# Altium schematic sheet Wheatstone bridge part III.SchDoc: Wheatstone bridge part III
size A4; SheetNumber: 4; SheetTotal: 5
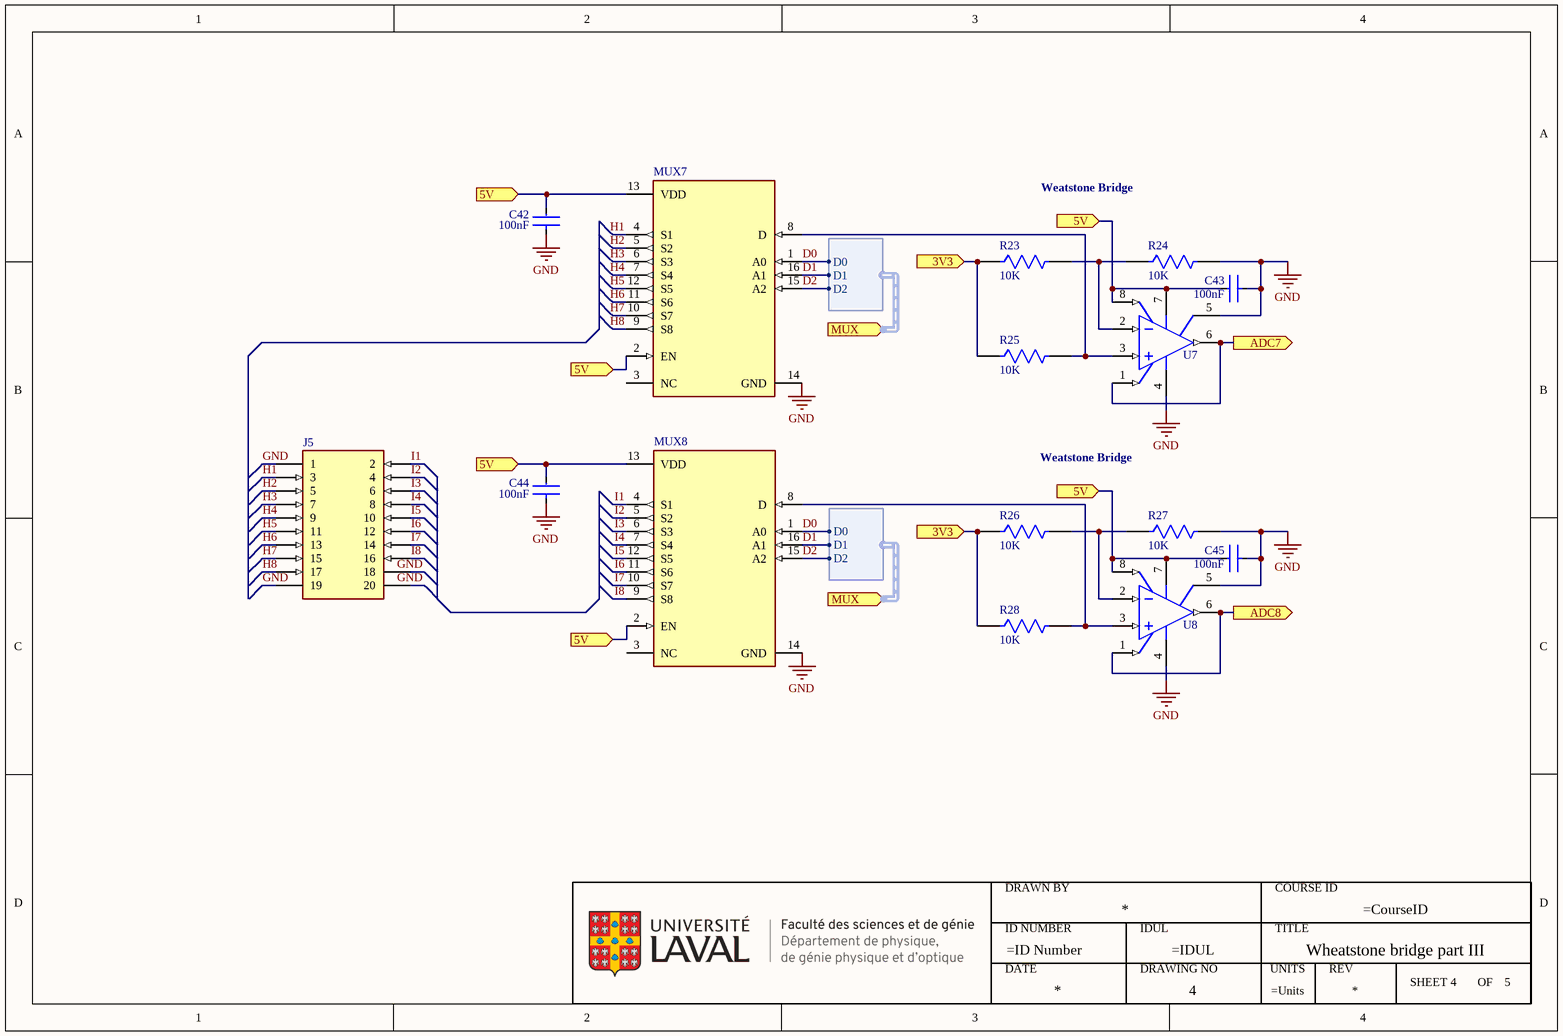
[diagram p0: Wheatstone bridge part III.SchDoc]

## Parts
*5  ULaval FSG-DPGPO  (value not drawn)  (graphical)
C42  value 100nF  [FP-CC0603-DA-IPC_B]  (hidden comment: CC0603JRX7R9BB104)
C43  value 100nF  [FP-CC0603-DA-IPC_B]  (hidden comment: CC0603JRX7R9BB104)
C44  value 100nF  [FP-CC0603-DA-IPC_B]  (hidden comment: CC0603JRX7R9BB104)
C45  value 100nF  [FP-CC0603-DA-IPC_B]  (hidden comment: CC0603JRX7R9BB104)
J5  SFC-110-T1-F-D-A  [SFC-110-T1-F-D-A-Footprint-2]  (value not drawn)
MUX7  TMUX1208PWR  [TMUX1208PWR]  (value not drawn)
MUX8  TMUX1208PWR  [TMUX1208PWR]  (value not drawn)
R23  value 10K  [FP-RT0603-IPC_B]  (hidden comment: RT0603BRD0710KL)
R24  value 10K  [FP-RT0603-IPC_B]  (hidden comment: RT0603BRD0710KL)
R25  value 10K  [FP-RT0603-IPC_B]  (hidden comment: RT0603BRD0710KL)
R26  value 10K  [FP-RT0603-IPC_B]  (hidden comment: RT0603BRD0710KL)
R27  value 10K  [FP-RT0603-IPC_B]  (hidden comment: RT0603BRD0710KL)
R28  value 10K  [FP-RT0603-IPC_B]  (hidden comment: RT0603BRD0710KL)
U7  MCP6N11-100E/SN  [MCP6N11-100E/SN]  (value not drawn)
U8  MCP6N11-100E/SN  [MCP6N11-100E/SN]  (value not drawn)

## Ports
3V3 (in), 5V (in), ADC7 (out), ADC8 (out), MUX (in, harness *)

## Harnesses
*: D0, D1, D2

## Nets
GND: C42.1 C43.1 C44.1 C45.1 J5.1 J5.18 J5.19 J5.20 MUX7.14(GND) MUX8.14(GND) R24.2 R27.2 U7.4(VSS) U7.5(VREF) U8.4(VSS) U8.5(VREF)
3V3: R23.1 R25.1 R26.1 R28.1 ; port 3V3
5V: C42.2 C43.2 C44.2 C45.2 MUX7.2(EN) MUX7.13(VDD) MUX8.2(EN) MUX8.13(VDD) U7.7(VDD) U7.8(EN/~{CAL}) U8.7(VDD) U8.8(EN/~{CAL}) ; port 5V
ADC7: U7.1(VFG) U7.6(VOUT) ; port ADC7
ADC8: U8.1(VFG) U8.6(VOUT) ; port ADC8
D0: MUX7.1(A0) MUX8.1(A0) ; port MUX.D0
D1: MUX7.16(A1) MUX8.16(A1) ; port MUX.D1
D2: MUX7.15(A2) MUX8.15(A2) ; port MUX.D2
H1: J5.3 MUX7.4(S1)
H2: J5.5 MUX7.5(S2)
H3: J5.7 MUX7.6(S3)
H4: J5.9 MUX7.7(S4)
H5: J5.11 MUX7.12(S5)
H6: J5.13 MUX7.11(S6)
H7: J5.15 MUX7.10(S7)
H8: J5.17 MUX7.9(S8)
I1: J5.2 MUX8.4(S1)
I2: J5.4 MUX8.5(S2)
I3: J5.6 MUX8.6(S3)
I4: J5.8 MUX8.7(S4)
I5: J5.10 MUX8.12(S5)
I6: J5.12 MUX8.11(S6)
I7: J5.14 MUX8.10(S7)
I8: J5.16 MUX8.9(S8)
NetMUX7_8: MUX7.8(D) R25.2 U7.3(VIP)
NetMUX8_8: MUX8.8(D) R28.2 U8.3(VIP)
NetR23_2: R23.2 R24.1 U7.2(VIM)
NetR26_2: R26.2 R27.1 U8.2(VIM)

Not connected (* = marked no-connect by the designer): MUX7 3(NC); MUX8 3(NC)

## Notes on the sheet
- Weatstone Bridge
- (in symbol ULaval FSG-DPGPO) DRAWN BY; COURSE ID; ID NUMBER; IDUL; TITLE; DATE; DRAWING NO; UNITS; REV; SHEET; OF

## Library data of the parts
C42-C45 = CMP-001-00097-1: 0603 0.1 uF 50 V ±5 % Tolerance X7R SMT Multilayer Ceramic Capacitor; Voltage Rating: 50V; Tolerance: 5%; Halogen Free: Halogen Free; Depth: 0.8mm; Case/Package: 0603; Dielectric: X7R; Thickness: 0.035inch; Series: CC; Termination: SMD/SMT; Voltage Rating (DC): 50V; Max Operating Temperature: 125°C; Weight: 7.1E-05oz; Construction: Flat; Resistor Type: Ceramic; Height: 0.8mm; Length: 0.063inch; RoHS Compliant: Yes; Lead Free: Lead Free; Pins: 2; Min Operating Temperature: -55°C; Case Code (Imperial): 0603; Radiation Hardening: No; Case Code (Metric): 1608; Mounting Technology: Surface Mount; Width: 0.031inch; Packaging: Tape and Reel
J5 = CMP-002-00080-2: Headers & Wire Housings .050 Tiger Eye Cost-Effective Reliable Socket Strip; Pitch: 0.05inch; Voltage Rating (AC): 350V; Connector Type: Receptacle; Number of Contacts: 20; Gender: Female; Insulation Color: Black; Max Operating Temperature: 125°C; Min Operating Temperature: -55°C; Insulation Material: Polymer; RoHS Compliant: Yes; Row Spacing: 0.05inch; Number of Rows: 2; Contact Shape: Square; Contact Type: Female Socket; Mounting Technology: Through Hole; Termination: Solder; Fastening Type: Pull; Contact Finish - Mating: GOLD; Color: Black; Packaging: Rail/Tube; Contact Material: Bronze; Contact Plating: Gold; Number of Positions: 20; Series: Tiger Eye™ SFC
MUX7 MUX8 = TMUX1208PWR: 5-V, 8: 1, 1-channel general-purpose analog multiplexer with 1.8-V input logic 16-TSSOP -40 to 125; Supplier 1: Digi-Key; Supplier Part Number 1: 296-51847-1-ND; Supplier 2: Digi-Key; Supplier Part Number 2: 296-51847-6-ND; Supplier 3: Digi-Key; Supplier Part Number 3: 296-51847-2-ND; ComponentLink1Description: Datasheet; ComponentLink1URL: https://www.ti.com/lit/ds/symlink/tmux1208.pdf?HQS=dis-dk-null-digikeymode-dsf-pf-null-wwe&ts=1678139087624&ref_url=https%253A%252F%252Fwww.ti.com%252Fgeneral%252Fdocs%252Fsuppproductinfo.tsp%253FdistId%253D10%2526gotoUrl%253Dhttps%253A%252F%252Fwww.ti.com%252Flit%252Fgpn%252Ftmux1208
R23-R28 = CMP-009-00178-1: Res High precision Thin Film 0603 10K Ohm 0.1% 1/10W ±25ppm/°C Molded SMD Paper T/R; Max Power Dissipation: 100mW; Working Voltage: 75V; RoHS Compliant: Yes; Power Rating: 100mW; Lead Free: Lead Free; Depth: 0.8mm; Case Code (Imperial): 0603; Max Operating Temperature: 155°C; Voltage Rating: 75V; Package Quantity: 5000; Packaging: Tape and Reel; Case/Package: 0603; Height: 0.022inch; Construction: Rectangular; Min Operating Temperature: -55°C; Termination: SMD/SMT; Features: Moisture Resistant; Number of Terminations: 2; Case Code (Metric): 1608; Technology: THIN FILM; Military Standard: Not; Length: 0.063inch; Voltage Rating (DC): 75V; Temperature Coefficient: 25ppm/°C; Weight: 7.1E-05oz; Width: 0.8mm; Series: RT; Resistor Type: Thin Film
U7 U8 = CMP-014-00010-7: MCP6N11 Series Single Channel 500 KHz 5.5 V Instrumentation Amplifier - SOIC-8; Bandwidth: 500kHz; Min Supply Voltage: 1.8V; Number of Elements: 2; Gain Bandwidth Product: 35MHz; Input Offset Voltage (Vos): 350uV; Number of Channels: 1; Nominal Supply Current: 800uA; Common Mode Rejection Ratio: 86dB; Slew Rate: 6V/µs; Max Supply Voltage: 5.5V; Slew Rate-Nom: 9V/µs; Input Bias Current: 10pA; Mounting Technology: Surface Mount; Package Quantity: 100; Pins: 8; Width: 3.9mm; Length: 4.9mm; Case/Package: SOIC; Min Operating Temperature: -40°C; Radiation Hardening: No; RoHS Compliant: Yes; Unity Gain Bandwidth Product: 35MHz; Lead Free: Lead Free; Number of Amplifiers: 1; Max Operating Temperature: 125°C; Height: 1.25mm; Packaging: Rail/Tube; Input Offset Voltage-Max: 350uV; Reach SVHC Compliant: Yes; Supply Current: 800uA; Max Supply Current: 800uA; Power Supply Rejection Ratio (PSRR): 86dB; Number of Circuits: 1